# EAGLE design ics-41350-breakout (EAGLE 9.1.3)
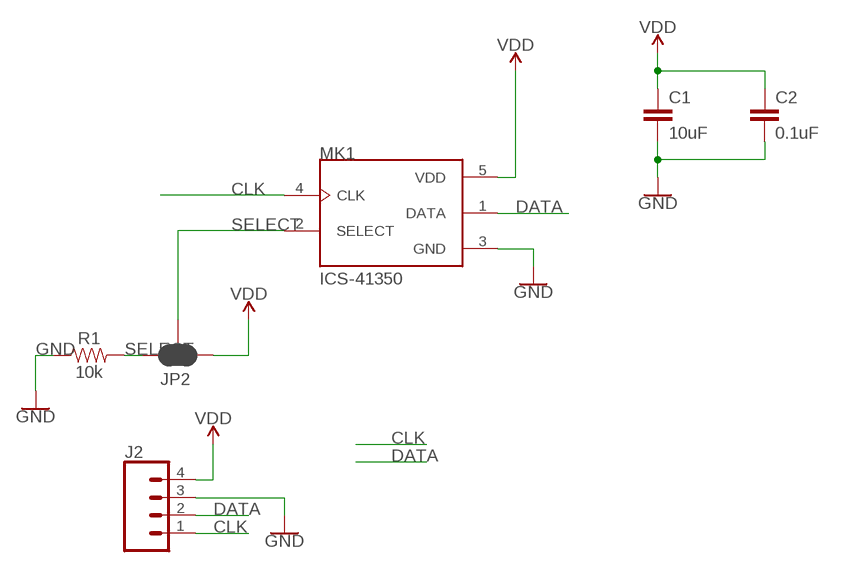
[diagram p0: schematic, sheet 1]

## Parts
C1  10uF  10UF-0805-10V-10%  [0805]
C2  0.1uF  0.1UF-0603-25V-(+80/-20%)  [0603]
J2  CONN_041X04_NO_SILK  [1X04_NO_SILK]
JP2  JUMPER-SMT_3_2-NC_PASTE_SILK  [SMT-JUMPER_3_2-NC_PASTE_SILK]
MK1  ICS-41350  [MIC_ICS-41350]
R1  10k  10KOHM-0603-1/10W-1%  [0603]

## Nets
CLK: J2.1 MK1.4(CLK)
DATA: J2.2 MK1.1(DATA)
GND: C1.2 C2.2 J2.3 MK1.3(GND) R1.1
SELECT: JP2.2 JP2.3 MK1.2(SELECT) R1.2
VDD: C1.1 C2.1 J2.4 JP2.1 MK1.5(VDD)

## Library data of the parts
C1 = SparkFun-Capacitors:10UF: 10.0µF ceramic capacitors A capacitor is a passive two-terminal electrical component used to store electrical energy temporarily in an electric field.; PROD_ID: CAP-11330
C2 = SparkFun-Capacitors:0.1UF: 0.1µF ceramic capacitors A capacitor is a passive two-terminal electrical component used to store electrical energy temporarily in an electric field.; PROD_ID: CAP-00810
J2 = SparkFun-Connectors:CONN_04: Multi connection point. Often used as Generic Header-pin footprint for 0.1 inch spaced/style header connections On any of the 0.1 inch spaced packages, you can populate with these: Break Away Headers - Straight <https://www.sparkfun.com/products/116> (PRT-00116) Break Away Male Headers - Right Angle <https://www.sparkfun.com/products/553> (PRT-00553) Female Headers <https://www.sparkfun.com/products/115> (PRT-00115) Break Away Headers - Machine Pin <https://www.sparkfun.com/products/117> (PRT-00117) Break Away Female Headers - Swiss Machine Pin <https://www.sparkfun.com/products/743> (PRT-00743) For SCREWTERMINALS and SPRING TERMINALS visit here: Screw Terimnals on SparkFun.com <https://www.sparkfun.com/search/results?term=Screw+Terminals> (5mm/3.5mm/2.54mm spacing) This device is also useful as a general connection point to wire up your design to another part of your project. Our various solder wires solder well into these plated through hole pads. Hook-Up Wire - Assortment (Stranded, 22 AWG) <https://www.sparkfun.com/products/11375> (PRT-11375) Hook-Up Wire - Assortment (Solid Core, 22 AWG) <https://www.sparkfun.com/products/11367> (PRT-11367) View the entire wire category on our website here <https://www.sparkfun.com/categories/141> Special notes: Molex polarized connector foot print use with SKU : PRT-08231 with associated crimp pins and housings. 1MM SMD Version SKU: PRT-10208; PROD_ID: CONN-09696
JP2 = SparkFun-Jumpers:JUMPER-SMT_3_2-NC_PASTE: Normally closed solder jumper (2 of 2 connections) This jumper has an aperture in the stencil to allow solder paste to bridge both connections. Both connections are normally closed (NC). Wick off the solder to open the connection(s). Reapply solder to reclose the connection(s).
MK1 = ICS-41350:ICS-41350: Bottom Port PDM Low Power muti-Mode Microphone with high AOP Mode; DESCRIPTION: Bottom Port PDM Low Power muti-Mode Microphone with high AOP Mode; DIGI-KEY_PART_NUMBER: 1428-1064-1-ND; DIGI-KEY_PURCHASE_URL: https://www.digikey.ca/product-detail/en/tdk-invensense/ICS-41350/1428-1064-1-ND/6025660?utm_source=snapeda&utm_medium=aggregator&utm_campaign=symbol; MF: TDK InvenSense; MP: ICS-41350; PACKAGE: LGA-5 TDK-InvenSense
R1 = SparkFun-Resistors:10KOHM: 10kΩ resistor A resistor is a passive two-terminal electrical component that implements electrical resistance as a circuit element. Resistors act to reduce current flow, and, at the same time, act to lower voltage levels within circuits. - Wikipedia; PROD_ID: RES-00824

## Board
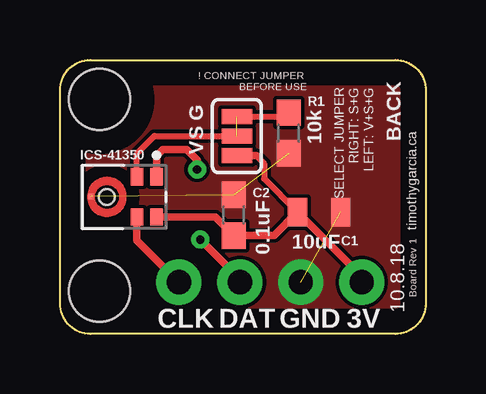
[diagram p1: board, top side]
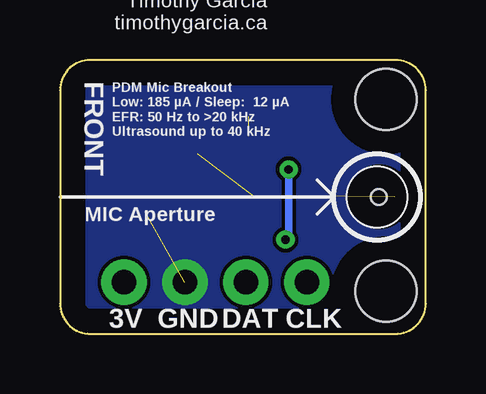
[diagram p2: board, bottom side, seen from below]

Size 15.24 x 11.43 mm. Coordinates in mm from the lower left corner, seen from the top.
Outline: 13.97,0 1.27,0 arc-90 0,1.27 0,10.16 arc-90 1.27,11.43 13.97,11.43 arc-90 15.24,10.16 15.24,1.27 arc-90 13.97,0
Copper layers (1*16): Top 0.035mm / dielectric 1.5mm / Bottom 0.035mm
Design rules "default": minimum track width 6mil, minimum drill 0.35mm, track to track 6mil, track to pad 6mil, pad to pad 6mil, via to via 6mil, smd to smd 6mil, copper to edge 40mil, drill to drill 6mil, minimum pad ring 10mil, minimum via ring 8mil, stop-mask expansion 4mil, vias tented up to drill 0mil, thermal gap 10mil
Holes 2.54 mm at 1.65,9.78 1.65,1.78

### Footprints (pad centres in the part's own frame; a part is rotated, then mirrored left to right if it is on the bottom)
0805 = smd 0.8 x 1.2: 1 -0.9,0; 2 0.9,0
0603 = smd 1.1 x 1: 1 -0.85,0; 2 0.85,0
1X04_NO_SILK = drill 1.016 pad 1.88: 1 0,0; 2 2.54,0; 3 5.08,0; 4 7.62,0
SMT-JUMPER_3_2-NC_PASTE_SILK = smd 0.635 x 1.27: 1 -0.813,0; 2 0,0; 3 0.813,0
MIC_ICS-41350 = smd 0.725 x 0.522: 1 -0.838,1.361; 2 -0.838,0.539; 4 0.838,0.539; 5 0.838,1.361 | smd 0.2 x 0.2: 3 -0.015,-1.383 | hole 0.65: 0,-0.713

### Placement (x,y rotation side)
C1  10.79,5.08 0 top
C2  7.24,4.95 90 top
J2  4.95,2.16 0 top
JP2  7.37,8.26 90 top
MK1  2.67,5.71 270 top
R1  9.53,8.38 90 top

### Tracks (layer width: path | path; a pad name or v marks a point on that pad's centre or on a via)
CLK
  Top 0.305: MK1.4 3.21,3.91 J2.1
DATA  (via drill 0.35)
  Top 0.305: v5.84,3.94 7.49,2.29 J2.2 | v5.71,6.86 5.71,7.26 5.28,7.7 4.28,7.7 4.03,7.44 MK1.1
  Bottom 0.305: v5.71,6.86 5.71,4.06 v5.84,3.94
GND  (3 unrouted)
  pour Top (no thermals): 0,0 0,11.43 15.24,11.43 15.24,0
  pour Bottom (no thermals): 0,11.43 15.24,11.43 15.24,0 0,0
SELECT  (1 unrouted)
  Top 0.254: MK1.2 3.21,7.52 3.94,8.26 JP2.2 | JP2.3 9.36,9.07 R1.2
VDD
  Top 0.254: 8.18,7.44 8.51,7.11 8.51,6.48 C1.1
  Top 0.305: J2.4 12.57,2.4 C1.1 8.92,4.1 C2.1 6.46,4.88 MK1.5 | JP2.1 8.18,7.44

### Text on the board
tPlace: ! CONNECT JUMPER / BEFORE USE | G | S | V | timothygarcia.ca | Board Rev 1 | 10.8.18
bPlace: Timothy Garcia / timothygarcia.ca | FRONT | PDM Mic Breakout / Low: 185 µA / Sleep: 12 µA / EFR: 50 Hz to >20 kHz / Ultrasound up to 40 kHz | MIC Aperture
tNames: BACK | SELECT JUMPER / RIGHT: S+G / LEFT: V+S+G | CLK | DAT | GND | 3V
bNames: CLK | DAT | GND | 3V